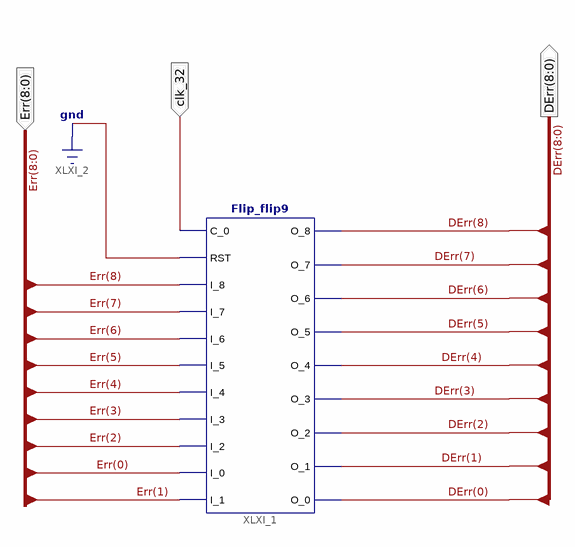
[diagram p0: schematic sheet 1]
// Xilinx ISE schematic D_error.sch (spartan3e) as structural Verilog: 1 symbols, 3 ports
module D_error (
  input  [8:0] Err,
  input  clk_32,
  output [8:0] DErr
);

  Flip_flip9 XLXI_1 (
    .C_0(clk_32), .RST(1'b0), .I_8(Err[8]), .I_7(Err[7]), .I_6(Err[6]), .I_5(Err[5]), .I_4(Err[4]),
    .I_3(Err[3]), .I_2(Err[2]), .I_0(Err[0]), .I_1(Err[1]), .O_8(DErr[8]), .O_7(DErr[7]), .O_6(DErr[6]),
    .O_5(DErr[5]), .O_4(DErr[4]), .O_3(DErr[3]), .O_2(DErr[2]), .O_1(DErr[1]), .O_0(DErr[0]));
endmodule
